# EAGLE design DriverBoard (EAGLE 7.2.0)
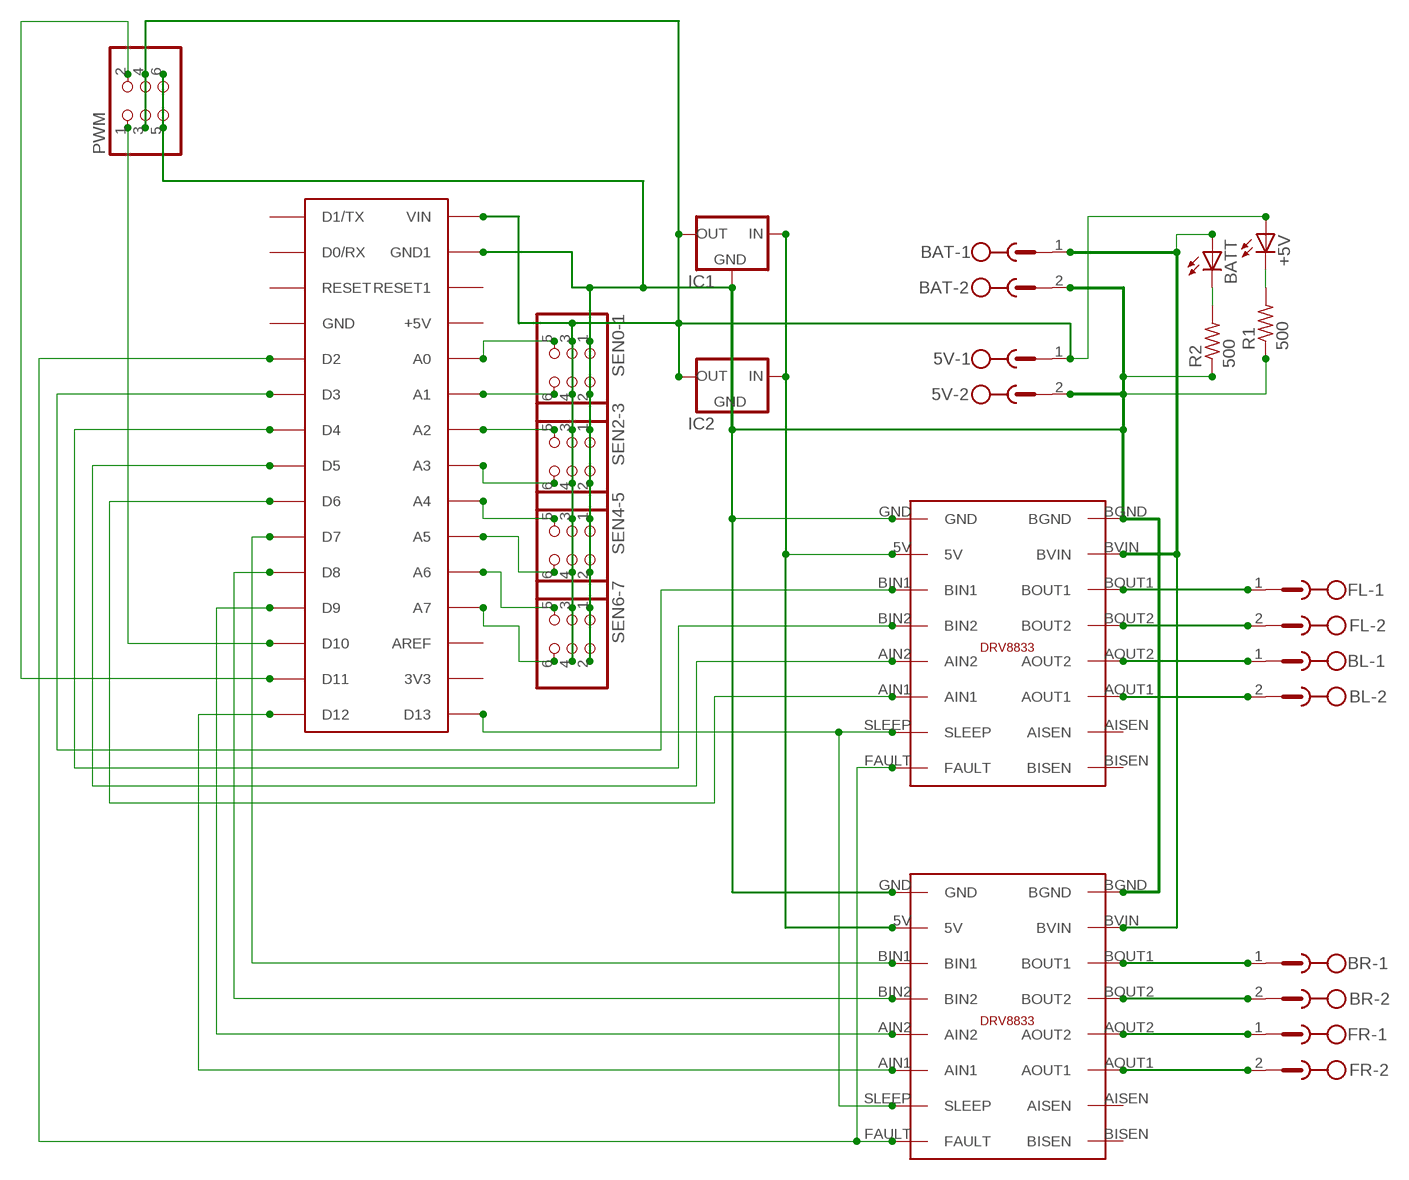
[diagram p0: schematic, sheet 1]

## Parts
5V  MSTBV2  [MSTBV2]
+5V  LED5MM  [LED5MM]
BAT  MSTBV2  [MSTBV2]
BATT  LED5MM  [LED5MM]
BL  MSTBV2  [MSTBV2]
BR  MSTBV2  [MSTBV2]
FL  MSTBV2  [MSTBV2]
FR  MSTBV2  [MSTBV2]
IC1  78XXS  [78XXS]
IC2  78XXS  [78XXS]
PWM  PINHD-2X3  [2X03]
R1  500  R-US_0207/10  [0207/10]
R2  500  R-US_0207/10  [0207/10]
SEN0-1  PINHD-2X3  [2X03]
SEN2-3  PINHD-2X3  [2X03]
SEN4-5  PINHD-2X3  [2X03]
SEN6-7  PINHD-2X3  [2X03]
U$1  ARDUINONANO  [PDIP-32]
U$2  DRV8833  [DRV8833]
U$3  DRV8833  [DRV8833]

## Nets
N$2: 5V.2 BAT.2 IC1.GND IC2.GND PWM.5 PWM.6 R1.1 R2.1 SEN0-1.1 SEN0-1.2 SEN2-3.1 SEN2-3.2 SEN4-5.1 SEN4-5.2 SEN6-7.1 SEN6-7.2 U$1.GND1 U$2.BGND U$2.GND U$3.BGND U$3.GND
N$4: FL.1 U$2.BOUT1
N$5: FL.2 U$2.BOUT2
N$6: BL.1 U$2.AOUT2
N$7: BL.2 U$2.AOUT1
N$8: BR.1 U$3.BOUT1
N$9: BR.2 U$3.BOUT2
N$10: FR.1 U$3.AOUT2
N$11: FR.2 U$3.AOUT1
N$12: BAT.1 BATT.A U$2.BVIN U$3.BVIN
N$13: U$1.D13 U$2.SLEEP U$3.SLEEP
N$14: IC1.IN IC2.IN U$2.5V U$3.5V
N$15: U$1.D3 U$2.BIN1
N$16: U$1.D2 U$2.FAULT U$3.FAULT
N$17: U$1.D4 U$2.BIN2
N$18: U$1.D5 U$2.AIN2
N$19: U$1.D6 U$2.AIN1
N$20: U$1.D7 U$3.BIN1
N$21: U$1.D8 U$3.BIN2
N$22: U$1.D9 U$3.AIN2
N$23: U$1.D12 U$3.AIN1
N$24: PWM.1 U$1.D10
N$25: PWM.2 U$1.D11
N$26: 5V.1 +5V.A IC1.OUT IC2.OUT PWM.3 PWM.4 SEN0-1.3 SEN0-1.4 SEN2-3.3 SEN2-3.4 SEN4-5.3 SEN4-5.4 SEN6-7.3 SEN6-7.4 U$1.VIN
N$27: SEN0-1.5 U$1.A0
N$28: SEN0-1.6 U$1.A1
N$29: SEN2-3.5 U$1.A2
N$30: SEN2-3.6 U$1.A3
N$31: SEN4-5.5 U$1.A4
N$32: SEN4-5.6 U$1.A5
N$33: SEN6-7.5 U$1.A6
N$34: SEN6-7.6 U$1.A7
N$35: BATT.K(C) R2.2
N$37: +5V.K(C) R1.2
Unconnected: U$1.3V3 U$1.+5V U$1.AREF U$1.D0/RX U$1.D1/TX U$1.GND U$1.RESET U$1.RESET1 U$2.AISEN U$2.BISEN U$3.AISEN U$3.BISEN

## Library data of the parts
5V BAT BL BR FL FR = con-phoenix-500:MSTBV2: PHOENIX; OC_FARNELL: unknown; OC_NEWARK: unknown
+5V BATT = led:LED: LED OSRAM: - CHIPLED LG R971, LG N971, LY N971, LG Q971, LY Q971, LO R971, LY R971 LH N974, LH R974 LS Q976, LO Q976, LY Q976 LO Q996 - Hyper CHIPLED LW Q18S LB Q993, LB Q99A, LB R99A - SideLED LS A670, LO A670, LY A670, LG A670, LP A670 LB A673, LV A673, LT A673, LW A673 LH A674 LY A675 LS A676, LA A676, LO A676, LY A676, LW A676 LS A679, LY A679, LG A679 - Hyper Micro SIDELED® LS Y876, LA Y876, LO Y876, LY Y876 LT Y87S - SmartLED LW L88C, LW L88S LB L89C, LB L89S, LG L890 LS L89K, LO L89K, LY L89K LS L896, LA L896, LO L896, LY L896 - TOPLED LS T670, LO T670, LY T670, LG T670, LP T670 LSG T670, LSP T670, LSY T670, LOP T670, LYG T670 LG T671, LOG T671, LSG T671 LB T673, LV T673, LT T673, LW T673 LH T674 LS T676, LA T676, LO T676, LY T676, LB T676, LH T676, LSB T676, LW T676 LB T67C, LV T67C, LT T67C, LS T67K, LO T67K, LY T67K, LW E67C LS E67B, LA E67B, LO E67B, LY E67B, LB E67C, LV E67C, LT E67C LW T67C LS T679, LY T679, LG T679 LS T770, LO T770, LY T770, LG T770, LP T770 LB T773, LV T773, LT T773, LW T773 LH T774 LS E675, LA E675, LY E675, LS T675 LS T776, LA T776, LO T776, LY T776, LB T776 LHGB T686 LT T68C, LB T68C - Hyper Mini TOPLED® LB M676 - Mini TOPLED Santana® LG M470 LS M47K, LO M47K, LY M47K Source: http://www.osram.convergy.de LUXEON: - LUMILED® LXK2-PW12-R00, LXK2-PW12-S00, LXK2-PW14-U00, LXK2-PW14-V00 LXK2-PM12-R00, LXK2-PM12-S00, LXK2-PM14-U00 LXK2-PE12-Q00, LXK2-PE12-R00, LXK2-PE12-S00, LXK2-PE14-T00, LXK2-PE14-U00 LXK2-PB12-K00, LXK2-PB12-L00, LXK2-PB12-M00, LXK2-PB14-N00, LXK2-PB14-P00, LXK2-PB14-Q00 LXK2-PR12-L00, LXK2-PR12-M00, LXK2-PR14-Q00, LXK2-PR14-R00 LXK2-PD12-Q00, LXK2-PD12-R00, LXK2-PD12-S00 LXK2-PH12-R00, LXK2-PH12-S00 LXK2-PL12-P00, LXK2-PL12-Q00, LXK2-PL12-R00 Source: www.luxeon.com KINGBRIGHT: KA-3528ASYC Source: www.kingbright.com
IC1 IC2 = v-reg:78XXS: VOLTAGE REGULATOR
PWM SEN0-1 SEN2-3 SEN4-5 SEN6-7 = pinhead:PINHD-2X3: PIN HEADER
R1 R2 = resistor:R-US_: RESISTOR, American symbol
U$1 = jet-lib:ARDUINONANO
U$2 U$3 = DRV8833:DRV8833: Dual H-Bridge Motor Driver

## Board
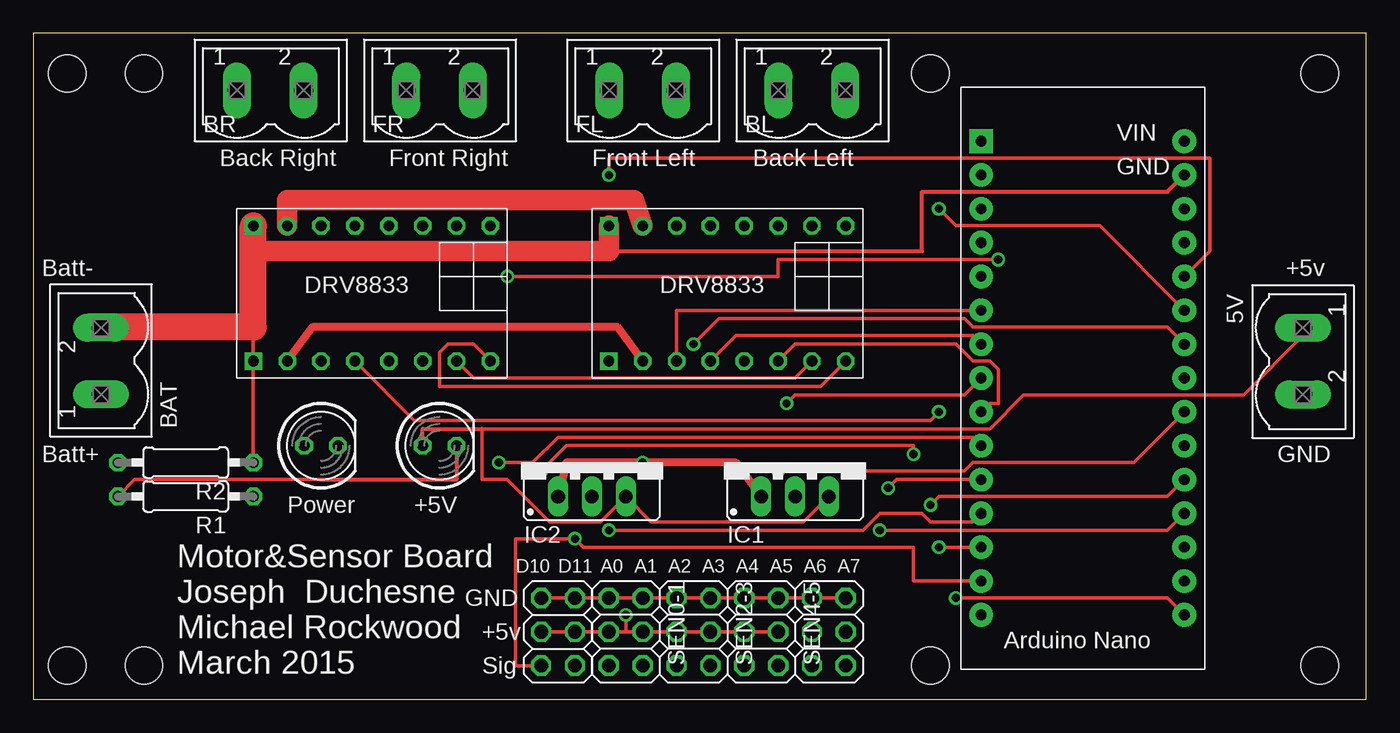
[diagram p1: board, top side]
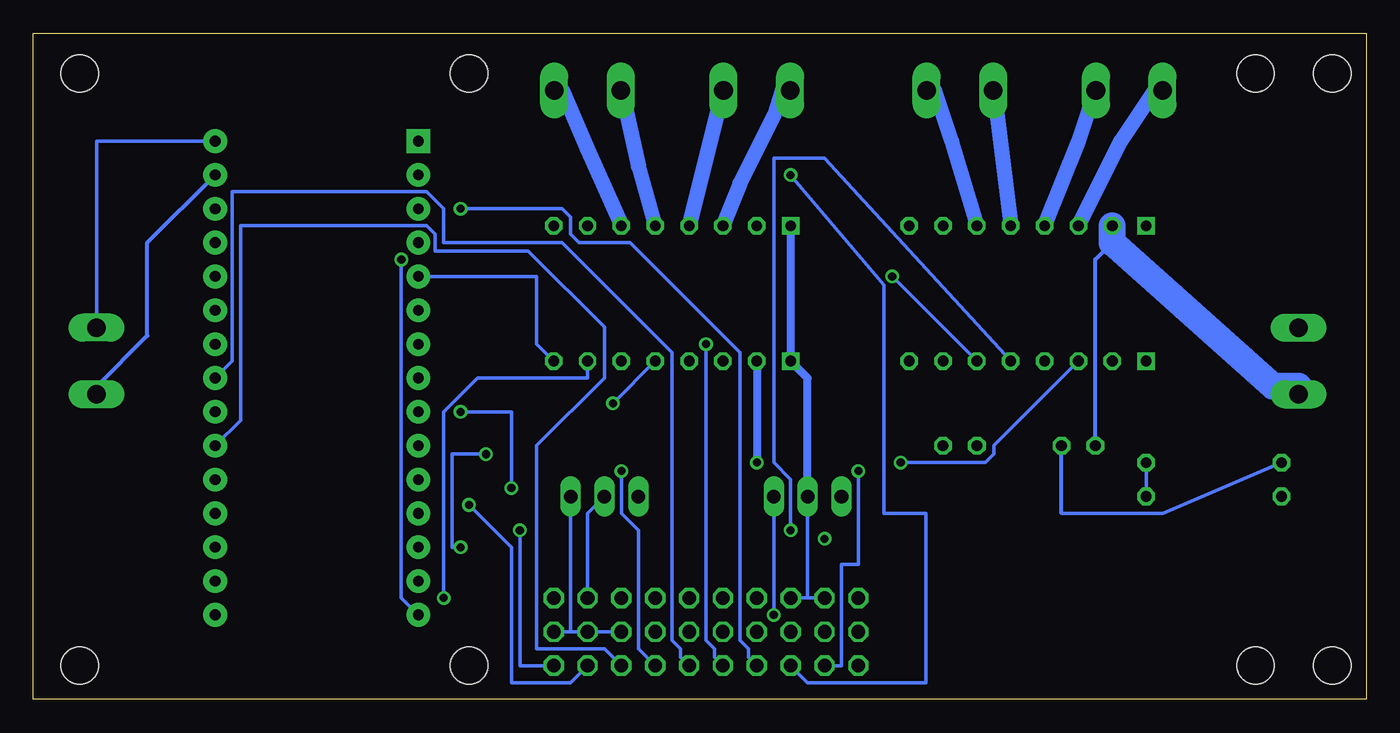
[diagram p2: board, bottom side, seen from below]

Size 100 x 50 mm. Coordinates in mm from the lower left corner, seen from the top.
Outline: 0,0 100,0 100,50 0,50 0,0
Copper layers (1*16): Top 0.035mm / dielectric 1.5mm / Bottom 0.035mm
Design rules "default": minimum track width 10mil, minimum drill 24mil, track to track 8mil, track to pad 8mil, pad to pad 8mil, via to via 8mil, smd to smd 8mil, copper to edge 40mil, drill to drill 8mil, minimum pad ring 10mil, minimum via ring 8mil, stop-mask expansion 4mil, vias tented up to drill 0mil, thermal gap 10mil
Holes 2.8 mm at 67.31,46.99 67.31,2.54 8.31,2.54 8.31,46.99 2.54,46.99 2.54,2.54 96.52,46.99 96.52,2.54

### Footprints (pad centres in the part's own frame; a part is rotated, then mirrored left to right if it is on the bottom)
MSTBV2 = drill 1.397 long: 1 -2.5,0; 2 2.5,0
LED5MM = drill 0.813 octagon: A -1.27,0; K 1.27,0
78XXS = drill 1.016 long: GND 0,-2.54; IN -2.54,-2.54; OUT 2.54,-2.54
2X03 = drill 1.016 octagon: 1 -2.54,-1.27; 2 -2.54,1.27; 3 0,-1.27; 4 0,1.27; 5 2.54,-1.27; 6 2.54,1.27
0207/10 = drill 0.813 octagon: 1 -5.08,0; 2 5.08,0
PDIP-32 = drill 0.8 pad 1.778: 3V3 15.24,-35.56; +5V 15.24,-10.16; A0 15.24,-12.7; A1 15.24,-15.24; A2 15.24,-17.78; A3 15.24,-20.32; A4 15.24,-22.86; A5 15.24,-25.4; A6 15.24,-27.94; A7 15.24,-30.48; AREF 15.24,-33.02; D0/RX 0,-5.08; D2 0,-12.7; D3 0,-15.24; D4 0,-17.78; D5 0,-20.32; D6 0,-22.86; D7 0,-25.4; D8 0,-27.94; D9 0,-30.48; D10 0,-33.02; D11 0,-35.56; D12 0,-38.1; D13 15.24,-38.1; GND 0,-10.16; GND1 15.24,-5.08; RESET 0,-7.62; RESET1 15.24,-7.62; VIN 15.24,-2.54 | drill 0.8 pad 1.778 square: D1/TX 0,-2.54
DRV8833 = drill 0.8 octagon: 5V 5.08,-6.35; AIN1 5.08,3.81; AIN2 5.08,1.27; AISEN -5.08,6.35; AOUT1 -5.08,3.81; AOUT2 -5.08,1.27; BIN1 5.08,-3.81; BIN2 5.08,-1.27; BISEN -5.08,8.89; BOUT1 -5.08,-3.81; BOUT2 -5.08,-1.27; BVIN -5.08,-6.35; FAULT 5.08,8.89; SLEEP 5.08,6.35 | drill 0.8 square: BGND -5.08,-8.89; GND 5.08,-8.89

### Placement (x,y rotation side)
5V  95.25,25.4 270 top
+5V  30.48,19.05 0 top
BAT  5.08,25.4 90 top
BATT  21.59,19.05 0 top
BL  58.42,45.72 0 top
BR  17.78,45.72 0 top
FL  45.72,45.72 0 top
FR  30.48,45.72 0 top
IC1  57.15,17.78 0 top
IC2  41.91,17.78 0 top
PWM  39.37,5.08 90 top
R1  11.43,15.24 180 top
R2  11.43,17.78 180 top
SEN0-1  44.45,5.08 270 top
SEN2-3  49.53,5.08 270 top
SEN4-5  54.61,5.08 270 top
SEN6-7  59.69,5.08 270 top
U$1  71.12,44.45 0 top
U$2  52.07,30.48 270 top
U$3  25.4,30.48 270 top

### Tracks (layer width: path | path; a pad name or v marks a point on that pad's centre or on a via)
N$2
  Top 0.254: R2.1 U$3.GND 16.51,27.94 | 5.08,27.94 BAT.2 | SEN6-7.2 SEN6-7.1 SEN4-5.2 SEN4-5.1 SEN2-3.2 SEN2-3.1 SEN0-1.2 SEN0-1.1 PWM.6
  Top 0.305: U$1.GND1 85.09,38.1 66.67,38.1 66.67,33.66 43.18,33.66
  Top 1.524: U$2.BGND 43.18,33.66 16.51,33.66
  Top 2.032: U$3.BGND 16.51,33.66 16.51,27.94 5.08,27.94
  Bottom 0.254: R2.1 R1.1 | 95.25,23.5 5V.2 | 41.91,7.62 IC2.GND | SEN0-1.1 41.91,7.62 | IC1.GND 58.42,13.97 SEN6-7.1 | 41.91,7.62 PWM.5
  Bottom 0.305: U$1.GND1 91.44,34.29 91.44,27.3 95.25,23.5
  Bottom 0.61: U$2.BGND U$2.GND 41.91,24.13 IC2.GND
N$4
  Bottom 0.254: 43.81,45.72 FL.1
  Bottom 1.143: U$2.BOUT1 46.99,38.73 44.45,43.81 43.81,45.72
N$5
  Bottom 0.254: 48.26,45.72 FL.2
  Bottom 1.143: 48.26,45.72 U$2.BOUT2
N$6
  Bottom 0.254: 55.88,45.72 BL.1
  Bottom 1.143: U$2.AOUT2 54.61,40.01 55.88,45.72
N$7
  Bottom 0.254: 60.33,45.72 BL.2
  Bottom 1.143: U$2.AOUT1 58.42,41.27 60.33,45.72
N$8
  Bottom 0.254: 15.88,45.72 BR.1
  Bottom 1.143: U$3.BOUT1 18.41,41.91 15.88,45.72
N$9
  Bottom 0.254: 20.32,45.72 BR.2
  Bottom 1.143: U$3.BOUT2 21.59,41.91 20.32,45.72
N$10
  Bottom 0.254: 27.94,45.72 FR.1
  Bottom 1.143: 27.94,45.72 U$3.AOUT2
N$11
  Bottom 0.254: 32.38,45.72 FR.2
  Bottom 1.143: U$3.AOUT1 31.11,41.91 32.38,45.72
N$12
  Top 1.524: U$2.BVIN 45.09,37.47 19.05,37.47 U$3.BVIN
  Bottom 0.254: 5.08,23.5 BAT.1
  Bottom 0.305: BATT.A 20.32,33.02 19.05,34.29
  Bottom 2.032: U$3.BVIN 19.05,34.29 6.99,23.5 5.08,23.5
N$13  (via drill 0.61)
  Top 0.254: U$3.SLEEP 33.02,24.13 57.15,24.13 U$2.SLEEP | U$1.D13 85.09,7.62 v69.22,7.62
  Bottom 0.254: v69.22,7.62 69.22,21.59 66.67,24.13 58.42,24.13 U$2.SLEEP
N$14  (via drill 0.61)
  Top 0.61: IC2.IN 40.01,17.78 v45.72,17.78 52.7,17.78 IC1.IN | U$3.5V 20.95,27.94 43.81,27.94 U$2.5V
  Bottom 0.61: U$2.5V v45.72,17.78
N$15
  Top 0.254: U$2.BIN1 48.26,29.21 U$1.D3
N$16
  Top 0.254: U$3.FAULT 33.02,26.67 31.11,26.67 30.48,26.04 30.48,23.5 59.05,23.5 U$2.FAULT
  Bottom 0.254: U$1.D2 62.23,31.75 62.23,26.67 U$2.FAULT
N$17
  Top 0.254: U$2.BIN2 52.7,27.3 70.48,27.3 U$1.D4
N$18  (via drill 0.61)
  Top 0.254: v56.52,22.23 57.15,22.86 69.85,22.86 U$1.D5
  Bottom 0.254: v56.52,22.23 U$2.AIN2
N$19
  Top 0.254: U$2.AIN1 57.15,26.67 69.22,26.67 70.48,25.4 71.75,25.4 72.39,24.77 72.39,22.23 71.75,22.23 U$1.D6
N$20  (via drill 0.61)
  Top 0.254: v34.92,17.78 37.47,17.78 39.37,19.68 70.48,19.68 U$1.D7
  Bottom 0.254: U$3.BIN1 27.94,19.05 27.94,18.41 28.57,17.78 v34.92,17.78
N$21  (via drill 0.61)
  Top 0.254: U$3.BIN2 28.57,20.95 67.31,20.95 v67.94,21.59 | v64.14,15.88 64.77,16.51 U$1.D8
  Bottom 0.254: v67.94,21.59 64.14,21.59 v64.14,15.88
N$22  (via drill 0.61)
  Top 0.254: v43.18,12.7 62.23,12.7 63.5,13.97 66.67,13.97 67.31,13.34 70.48,13.34 U$1.D9
  Bottom 0.254: U$3.AIN2 40.64,40.64 44.45,40.64 44.45,17.78 43.18,16.51 v43.18,12.7
N$23  (via drill 0.61)
  Top 0.254: v35.56,31.75 55.88,31.75 55.88,33.02 v72.39,33.02
  Bottom 0.254: v35.56,31.75 U$3.AIN1 | v72.39,33.02 72.39,7.62 U$1.D12
N$24  (via drill 0.61)
  Top 0.254: v38.1,17.14 40.01,19.05 66.04,19.05 v66.04,18.41 | U$1.D10 v67.94,11.43
  Bottom 0.254: v38.1,17.14 38.1,10.16 39.37,10.16 39.37,2.54 PWM.1 | v66.04,18.41 68.58,18.41 68.58,11.43 v67.94,11.43
N$25  (via drill 0.61)
  Top 0.254: PWM.2 36.2,2.54 36.2,12.06 v40.64,12.06 41.27,11.43 66.04,11.43 66.04,8.89 U$1.D11
N$26  (via drill 0.61)
  Top 0.254: IC1.OUT 57.78,13.34 46.35,13.34 IC2.OUT 42.55,13.34 38.73,13.34 35.56,16.51 33.66,16.51 33.66,20.32 71.75,20.32 74.3,22.86 90.81,22.86 95.25,27.3 5V.1 | PWM.4 PWM.3 SEN0-1.3 44.45,5.08 | v44.45,6.35 44.45,5.08 | 44.45,5.08 SEN0-1.4 SEN2-3.3 SEN2-3.4 SEN4-5.3 SEN4-5.4
  Top 0.305: +5V.A 29.21,20.32 33.66,20.32
  Bottom 0.254: U$1.VIN 95.25,41.91 5V.1 | SEN4-5.4 SEN6-7.3 59.69,5.08 | 59.69,5.08 IC1.OUT | 59.69,5.08 SEN6-7.4 | IC2.OUT v44.45,6.35
N$27  (via drill 0.61)
  Top 0.254: v43.18,39.37 43.18,40.64 88.27,40.64 88.27,33.66 U$1.A0
  Bottom 0.254: SEN0-1.5 41.91,1.27 33.02,1.27 33.02,13.97 36.2,13.97 36.2,31.11 v43.18,39.37
N$28  (via drill 0.61)
  Top 0.254: v67.94,36.83 69.22,35.56 80.01,35.56 U$1.A1
  Bottom 0.254: SEN0-1.6 46.35,3.17 46.35,3.81 46.99,4.45 46.99,26.04 55.24,34.29 59.05,34.29 59.69,34.92 59.69,36.2 60.33,36.83 v67.94,36.83
N$29  (via drill 0.61)
  Top 0.254: v49.53,26.67 51.44,28.57 69.85,28.57 70.48,27.94 85.09,27.94 U$1.A2
  Bottom 0.254: SEN2-3.5 48.9,3.17 48.9,3.81 49.53,4.45 v49.53,26.67
N$30
  Bottom 0.254: SEN2-3.6 51.44,3.17 51.44,3.81 52.07,4.45 52.07,26.04 60.33,34.29 69.22,34.29 69.22,36.83 70.48,38.1 85.09,38.1 85.09,25.4 U$1.A3
N$31  (via drill 0.61)
  Top 0.254: v55.88,17.14 69.85,17.14 70.48,17.78 82.55,17.78 U$1.A4
  Bottom 0.254: SEN4-5.5 54.61,3.81 54.61,12.7 55.88,13.97 v55.88,17.14
N$32
  Bottom 0.254: SEN4-5.6 57.15,3.81 62.23,3.81 62.23,19.05 57.15,24.13 57.15,27.94 62.87,33.66 69.85,33.66 69.85,34.92 70.48,35.56 84.45,35.56 84.45,20.95 U$1.A5
N$33  (via drill 0.61)
  Top 0.254: v67.31,14.61 67.94,15.24 85.09,15.24 U$1.A6
  Bottom 0.254: SEN6-7.5 59.69,1.27 64.14,1.27 64.14,11.43 v67.31,14.61
N$34  (via drill 0.61)
  Top 0.254: v63.5,12.7 85.09,12.7 U$1.A7
  Bottom 0.254: SEN6-7.6 63.5,2.54 v63.5,12.7
N$35
  Bottom 0.254: R2.2 15.24,13.97 22.86,13.97
  Bottom 0.305: 22.86,13.97 BATT.K
N$37
  Top 0.254: R1.2 7.62,16.51 21.59,16.51
  Top 0.305: +5V.K 31.75,16.51 21.59,16.51

### Text on the board
tNames: Back Right | Front Right | Front Left | Back Left | Batt- | +5v | Batt+ | GND | Power | +5V | D10 | D11 | A0 | A1 | A2 | A3 | A4 | A5 | A6 | A7 | GND | +5v | Motor&Sensor Board / Joseph Duchesne / Michael Rockwood / March 2015 | Sig